# Altium schematic sheet Pot_Board1_fab.SchDoc: CSN Detector V5
size A4; Author: RCP; DrawnBy: RCP; Address1: LIM-HGGM; Address3: RCP; DocumentNumber: 1; Revision: 1; SheetNumber: 1; SheetTotal: 2; PageSetup: Record=PageOptions|CenterHorizontal=True|CenterVertical=True|PrintScale=0.97|XCorrection=1.00|YCorrection=1.00|PrintKind=0|BorderSize=5000000|LeftOffset=0|BottomOffset=0|Orientation=2|PaperLength=2970|PaperWidth=2100|Scale=100|PaperSource=7|PrintQuality=600|MediaType=1|DitherType=10|PaperKind=A4|PrintScaleMode=1
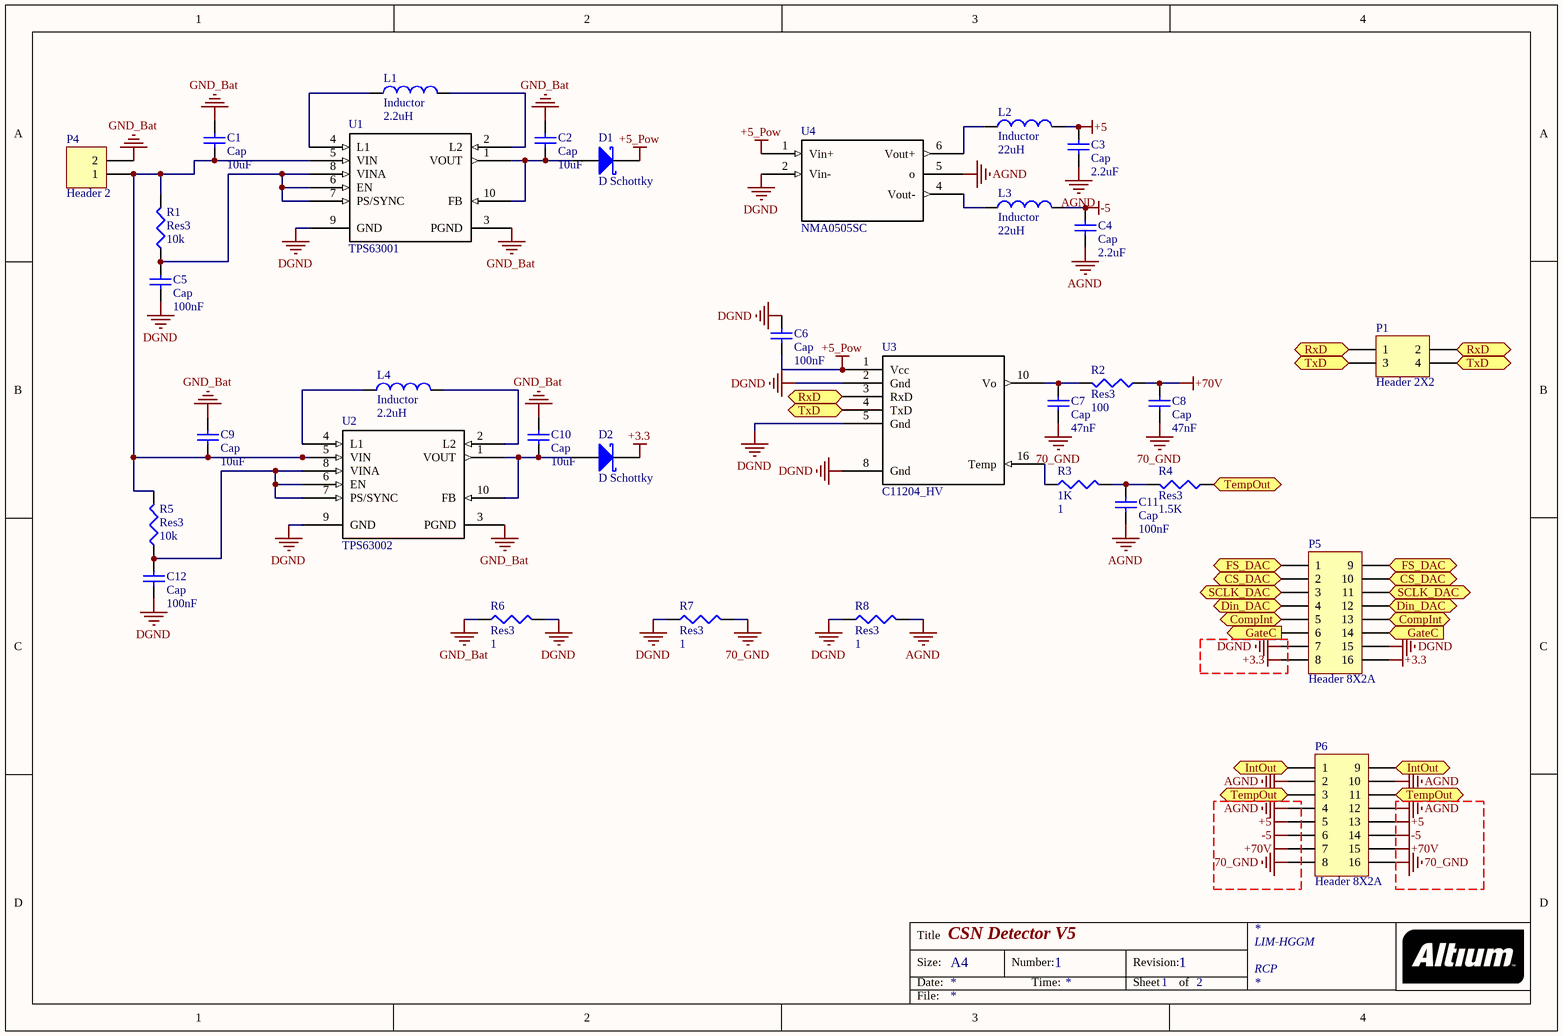
[diagram p0: Pot_Board1_fab.SchDoc]

## Parts
C1  Cap  value 10uF  [C0805]
C2  Cap  value 10uF  [C0805]
C3  Cap  value 2.2uF  [6-0805_N]
C4  Cap  value 2.2uF  [6-0805_N]
C5  Cap  value 100nF  [J1-0603]
C6  Cap  value 100nF  [C0805]
C7  Cap  value 47nF  [J1-0603]
C8  Cap  value 47nF  [J1-0603]
C9  Cap  value 10uF  [C0805]
C10  Cap  value 10uF  [C0805]
C11  Cap  value 100nF  [J1-0603]
C12  Cap  value 100nF  [J1-0603]
D1  D Schottky  [J1-0603]
D2  D Schottky  [J1-0603]
L1  Inductor  value 2.2uH  [C1210_L]
L2  Inductor  value 22uH  [C1210]
L3  Inductor  value 22uH  [C1210]
L4  Inductor  value 2.2uH  [C1210_L]
P1  Header 2X2  [HDR2X2]
P4  Header 2  [HDR1X2]
P5  Header 8X2A  [HDR2X8_CEN]
P6  Header 8X2A  [HDR2X8_CEN]
R1  Res3  value 10k  [J1-0603]
R2  Res3  value 100  [J1-0603]
R3  1K  value 1  [J1-0603]
R4  Res3  value 1.5K  [J1-0603]
R5  Res3  value 10k  [J1-0603]
R6  Res3  value 1  [J1-0603]
R7  Res3  value 1  [J1-0603]
R8  Res3  value 1  [J1-0603]
U1  TPS63001  [DRC10_2P4X1P65]
U2  TPS63002  [DRC10_2P4X1P65]
U3  C11204_HV  [C11204_HAM]
U4  NMA0505SC  [NMA0505SC_SIP]

## Ports
CompInt (out), CS_DAC (out), Din_DAC (out), FS_DAC (out), GateC (out), IntOut (out), RxD (out), SCLK_DAC (out), TempOut (out), TxD (out)

## Nets
70_GND: C7.1 C8.1 P6.8 P6.16 R7.2
+3.3: D2.2(K) P5.8 P5.16
+5: C3.1 L2.2 P6.5 P6.13
+5_Pow: C6.2 D1.2(K) U3.1(Vcc) U4.1(Vin+)
+70V: C8.2 P6.7 P6.15 R2.1
-5: C4.2 L3.2 P6.6 P6.14
AGND: C3.2 C4.1 C11.1 P6.2 P6.4 P6.10 P6.12 R8.2 U4.5(o)
DGND: C5.2 C6.1 C12.2 P5.7 P5.15 R6.2 R7.1 R8.1 U1.9(GND) U2.9(GND) U3.2(Gnd) U3.5(Gnd) U3.8(Gnd) U4.2(Vin-)
GND_Bat: C1.2 C2.2 C9.2 C10.2 P4.2 R6.1 U1.3(PGND) U2.3(PGND)
CompInt: P5.5 P5.13 ; port CompInt
CS_DAC: P5.2 P5.10 ; port CS_DAC
Din_DAC: P5.4 P5.12 ; port Din_DAC
FS_DAC: P5.1 P5.9 ; port FS_DAC
GateC: P5.6 P5.14 ; port GateC
IntOut: P6.1 P6.9 ; port IntOut
RxD: P1.1 P1.2 U3.3(RxD) ; port RxD
SCLK_DAC: P5.3 P5.11 ; port SCLK_DAC
TempOut: P6.3 P6.11 R4.1 ; port TempOut
TxD: P1.3 P1.4 U3.4(TxD) ; port TxD
NetC1_1: C1.1 C9.1 P4.1 R1.2 R5.2 U1.5(VIN) U2.5(VIN)
NetC2_1: C2.1 D1.1(A) U1.1(VOUT) U1.10(FB)
NetC5_1: C5.1 R1.1 U1.6(EN) U1.7(PS/SYNC) U1.8(VINA)
NetC7_2: C7.2 R2.2 U3.10(Vo)
NetC10_1: C10.1 D2.1(A) U2.1(VOUT) U2.10(FB)
NetC11_2: C11.2 R3.2 R4.2
NetC12_1: C12.1 R5.1 U2.6(EN) U2.7(PS/SYNC) U2.8(VINA)
NetL1_1: L1.1 U1.4(L1)
NetL1_2: L1.2 U1.2(L2)
NetL2_1: L2.1 U4.6(Vout+)
NetL3_1: L3.1 U4.4(Vout-)
NetL4_1: L4.1 U2.4(L1)
NetL4_2: L4.2 U2.2(L2)
NetR3_1: R3.1 U3.16(Temp)

Not connected (* = marked no-connect by the designer): U3 6(NC) 7(HV) 9(NC) 11(NC) 12(NC) 13(NC) 14(NC) 15(NC)

## Notes on the sheet
- Title
- Size:
- Date:
- A4
- Number:
- Time:
- Revision:
- Sheet
- of
- File:

## Library data of the parts
C1-C12 = Cap: Capacitor; Published: 8-Jun-2000; LatestRevisionDate: 17-Jul-2002; LatestRevisionNote: Re-released for DXP Platform.; PackageReference: RAD-0.3; Publisher: Altium Limited; PackageDescription: Radial Cap, Thru-Hole; 2 Leads; 0.3 in Pin Spacing
  C1 C2 C5 C6 C9 C10 C12: Cod Farnell: 1735528
D1 D2 = D Schottky: Schottky Diode; Published: 8-Jun-2000; LatestRevisionDate: 17-Jul-2002; LatestRevisionNote: Re-released for DXP Platform.; PackageReference: SMB; Publisher: Altium Limited; PackageDescription: DO-214-AA/SMB; 2 C-Bend Leads; Body 5.3 x 3.6 mm, inc. leads (LxW); Code_JEDEC: DO-214-AA; Cod Farnell: CD0603-B00340
L1-L4 = Inductor: Code_IEC: 1005; Published: 8-Jun-2000; LatestRevisionDate: 29-May-2009; LatestRevisionNote: IPC-7351 Footprint Added.; PackageReference: 0402-A; Publisher: Altium Limited; PackageDescription: Chip Inductor; Code_JEITA: 0402
  L1 L4: Cod Farnell: 2219261
P1 = Header 2X2: Header, 2-Pin, Dual row; LatestRevisionDate: 17-Jul-2002; LatestRevisionNote: Re-released for DXP Platform.; Publisher: Altium Limited
P4 = Header 2: Header, 2-Pin; LatestRevisionDate: 17-Jul-2002; LatestRevisionNote: Re-released for DXP Platform.; Publisher: Altium Limited
P5 P6 = Header 8X2A: Header, 8-Pin, Dual row; LatestRevisionDate: 17-Jul-2002; LatestRevisionNote: Re-released for DXP Platform.; Publisher: Altium Limited
R1-R8 = Res3: Resistor; Published: 8-Jun-2000; LatestRevisionDate: 29-May-2009; LatestRevisionNote: IPC-7351 Footprint Added.; PackageReference: J1-0603; Publisher: Altium Limited; PackageDescription: Chip Resistor
U1 U2 = TPS63001_DRC_10: Imported; Vendor: Texas Instruments; PACKAGE_DESIGNATOR: DRC; PIN_COUNT: 10; FAMILY_NAME: BUCK-BOOST REGULATOR; INDUSTRY_STD_PKG_TYPE: SON; Manufacturer_Part_Number: tps63001_drc_10; GENERIC_PART_NUMBER: TPS63001; Datasheet URL: http://www.ti.com/lit/gpn/TPS63001; Manufacturer: Texas Instruments; RefDes: RefDes; Type: DEV; Value: Value